# EAGLE schematic Expansion Port (EAGLE 9.6.2)
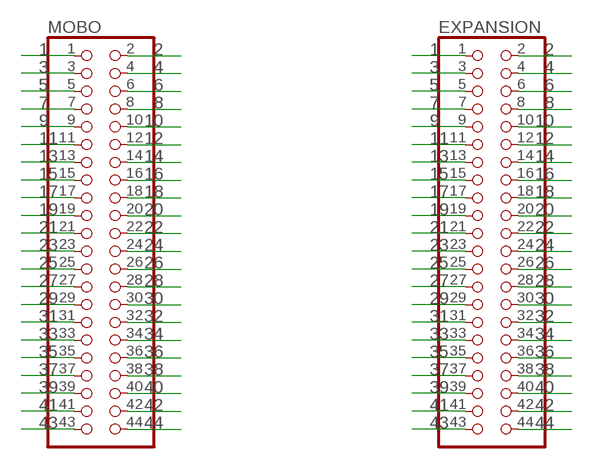
[diagram p0: schematic, sheet 1]

## Parts
EXPANSION  PINHD-2X22  [2X22]
MOBO  PINHD-2X22  [2X22]

## Nets
1: EXPANSION.1 MOBO.1
2: EXPANSION.2 MOBO.2
3: EXPANSION.3 MOBO.3
4: EXPANSION.4 MOBO.4
5: EXPANSION.5 MOBO.5
6: EXPANSION.6 MOBO.6
7: EXPANSION.7 MOBO.7
8: EXPANSION.8 MOBO.8
9: EXPANSION.9 MOBO.9
10: EXPANSION.10 MOBO.10
11: EXPANSION.11 MOBO.11
12: EXPANSION.12 MOBO.12
13: EXPANSION.13 MOBO.13
14: EXPANSION.14 MOBO.14
15: EXPANSION.15 MOBO.15
16: EXPANSION.16 MOBO.16
17: EXPANSION.17 MOBO.17
18: EXPANSION.18 MOBO.18
19: EXPANSION.19 MOBO.19
20: EXPANSION.20 MOBO.20
21: EXPANSION.21 MOBO.21
22: EXPANSION.22 MOBO.22
23: EXPANSION.23 MOBO.23
24: EXPANSION.24 MOBO.24
25: EXPANSION.25 MOBO.25
26: EXPANSION.26 MOBO.26
27: EXPANSION.27 MOBO.27
28: EXPANSION.28 MOBO.28
29: EXPANSION.29 MOBO.29
30: EXPANSION.30 MOBO.30
31: EXPANSION.31 MOBO.31
32: EXPANSION.32 MOBO.32
33: EXPANSION.33 MOBO.33
34: EXPANSION.34 MOBO.34
35: EXPANSION.35 MOBO.35
36: EXPANSION.36 MOBO.36
37: EXPANSION.37 MOBO.37
38: EXPANSION.38 MOBO.38
39: EXPANSION.39 MOBO.39
40: EXPANSION.40 MOBO.40
41: EXPANSION.41 MOBO.41
42: EXPANSION.42 MOBO.42
43: EXPANSION.43 MOBO.43
44: EXPANSION.44 MOBO.44

## Library data of the parts
EXPANSION MOBO = pinhead:PINHD-2X22: PIN HEADER